# Altium schematic sheet mag_pos_con_FX-30.SchDoc
size A4
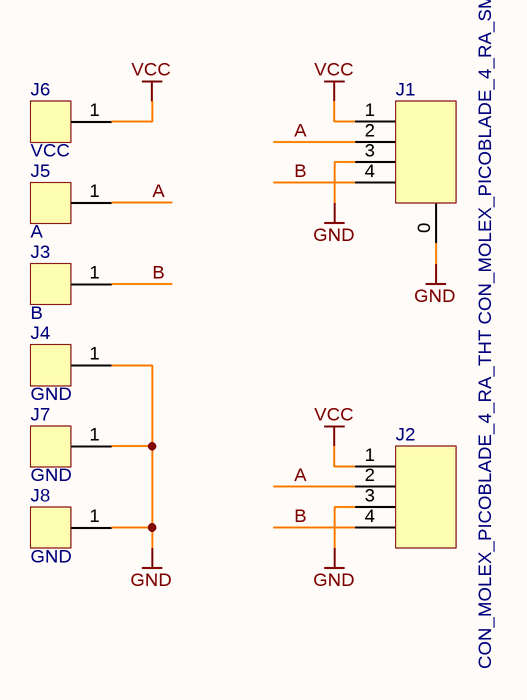
[diagram p0: mag_pos_con_FX-30.SchDoc]

## Parts
J1  CON_MOLEX_PICOBLADE_4_RA_SMT  [CON_MOLEX_PICOBLADE_4_RA_SMT]
J2  CON_MOLEX_PICOBLADE_4_RA_THT  [CON_MOLEX_PICOBLADE_4_RA_THT]
J3  B  [CON_1X1_WIRE_0.034MM2_RELIEF]
J4  GND  [CON_1X1_WIRE_0.034MM2_RELIEF]
J5  A  [CON_1X1_WIRE_0.034MM2_RELIEF]
J6  VCC  [CON_1X1_WIRE_0.034MM2_RELIEF]
J7  GND  [CON_1X1_WIRE_0.5MM2_RELIEF]
J8  GND  [CON_1X1_WIRE_0.5MM2_RELIEF]

## Nets
GND: J1.0 J1.3 J2.3 J4.1 J7.1 J8.1
VCC: J1.1 J2.1 J6.1
A: J1.2 J2.2 J5.1
B: J1.4 J2.4 J3.1

## Library data of the parts
J1 = CON_MOLEX_PICOBLADE_4_RA_SMT: Molex Picoblade, 4 pins, Right Angle, SMT, 532617004
J2 = CON_MOLEX_PICOBLADE_4_RA_THT: Molex Picoblade, 4 pins, Right Angle, THT, 532617004
J3-J6 = Wire_0.034MM2_RELIEF: 0.034mm^2 wire with strain relief; System: Connector
J7 J8 = Wire_0.5MM2_RELIEF: 0.5mm^2 wire with strain relief; System: Connector